# Altium project Volta_P0_Single_Port.PrjPcb (part 2 of 3)

## Sheet Charging_TI.SchDoc
size A4
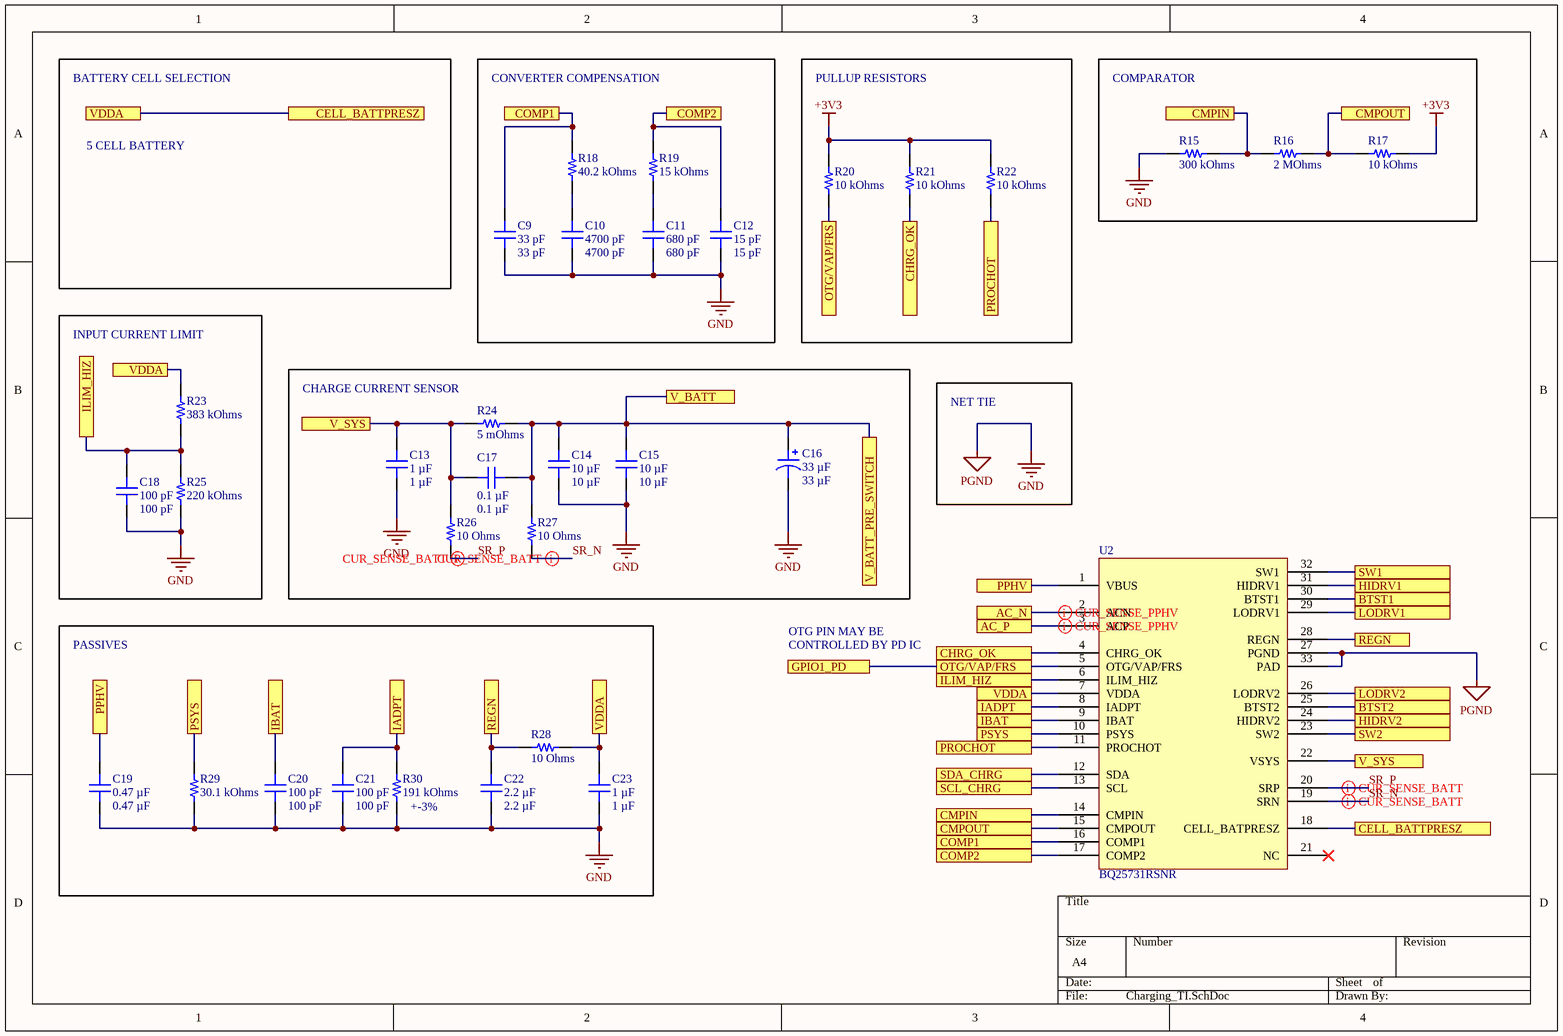
[diagram p2: Charging_TI.SchDoc]

### Parts
C9  33 pF  [CAP 0402_1005]
C10  4700 pF  [CAP 0402_1005]
C11  680 pF  [CAP 0402_1005]
C12  15 pF  [CAP 0402_1005]
C13  1 µF  [CAP 0402_1005]
C14  10 µF  [CAP 0805_2012]
C15  10 µF  [CAP 0805_2012]
C16  33 µF  [CAP POL 2917_7343]
C17  0.1 µF  [CAP 0603_1608]
C18  100 pF  [CAP 0603_1608]
C19  0.47 µF  [CAP 0805_2012]
C20  100 pF  [CAP 0603_1608]
C21  100 pF  [CAP 0603_1608]
C22  2.2 µF  [CAP 0603_1608]
C23  1 µF  [CAP 0603_1608]
R15  300 kOhms  [RES 0402_1005]
R16  2 MOhms  [RES 0402_1005]
R17  10 kOhms  [RES 0402_1005]
R18  40.2 kOhms  [RES 0402_1005]
R19  15 kOhms  [RES 0402_1005]
R20  10 kOhms  [RES 0402_1005]
R21  10 kOhms  [RES 0402_1005]
R22  10 kOhms  [RES 0402_1005]
R23  383 kOhms  [RES 0402_1005]
R24  5 mOhms  [RES 1206_3216]
R25  220 kOhms  [RES 0402_1005]
R26  10 Ohms  [RES 0603_1608]
R27  10 Ohms  [RES 0603_1608]
R28  10 Ohms  [RES 0603_1608]
R29  30.1 kOhms  [RES 0402_1005]
R30  191 kOhms  [RES 0402_1005]
U2  BQ25731RSNR  [QFN40P400X400X80_HS-33N]

### Blocks framed on the sheet
CONVERTER COMPENSATION: C9-C12 R18 R19
PULLUP RESISTORS: R20-R22
COMPARATOR: R15-R17
INPUT CURRENT LIMIT: C18 R23 R25
CHARGE CURRENT SENSOR: C13-C17 R24 R26 R27

### Ports
AC_N, AC_P, BTST1, BTST2, CELL_BATTPRESZ, CHRG_OK, CMPIN, CMPOUT, COMP1, COMP2, GPIO1_PD, HIDRV1, HIDRV2, IADPT, IBAT, ILIM_HIZ, LODRV1, LODRV2, OTG/VAP/FRS, PPHV, PROCHOT, PSYS, REGN, SCL_CHRG, SDA_CHRG, SW1, SW2, V_BATT, V_BATT_PRE_SWITCH, V_SYS, VDDA

### Nets
+3V3: R17.1 R20.2 R21.2 R22.2
GND: C9.1 C10.1 C11.1 C12.1 C13.2 C14.1 C15.1 C16.2 C18.1 C19.1 C20.1 C21.1 C22.1 C23.1 R15.1 R25.1 R29.1 R30.1 U2.27(PGND) U2.33(PAD)  [also labelled PGND]  [project net FUEL_BATT_SR_N]
AC_N: U2.2(ACN) ; port AC_N
AC_P: U2.3(ACP) ; port AC_P
BTST1: U2.30(BTST1) ; port BTST1
BTST2: U2.25(BTST2) ; port BTST2
CELL_BATTPRESZ: C23.2 R23.2 R28.2 U2.7(VDDA) U2.18(CELL_BATPRESZ) ; port CELL_BATTPRESZ, port VDDA
CHRG_OK: R21.1 U2.4(CHRG_OK) ; port CHRG_OK
CMPIN: R15.2 R16.1 U2.14(CMPIN) ; port CMPIN
CMPOUT: R16.2 R17.2 U2.15(CMPOUT) ; port CMPOUT
COMP1: C9.2 R18.2 U2.16(COMP1) ; port COMP1
COMP2: C12.2 R19.2 U2.17(COMP2) ; port COMP2
GPIO1_PD: R20.1 U2.5(OTG/VAP/FRS) ; port OTG/VAP/FRS, port GPIO1_PD
GPIO5_M: R22.1 U2.11(PROCHOT) ; port PROCHOT
HIDRV1: U2.31(HIDRV1) ; port HIDRV1
HIDRV2: U2.24(HIDRV2) ; port HIDRV2
I2CM_SCL: U2.13(SCL) ; port SCL_CHRG
I2CM_SDA: U2.12(SDA) ; port SDA_CHRG
IADPT: C21.2 R30.2 U2.8(IADPT) ; port IADPT
IBAT: C20.2 U2.9(IBAT) ; port IBAT
ILIM_HIZ: C18.2 R23.1 R25.2 U2.6(ILIM_HIZ) ; port ILIM_HIZ
LODRV1: U2.29(LODRV1) ; port LODRV1
LODRV2: U2.26(LODRV2) ; port LODRV2
PPHV: C19.2 U2.1(VBUS) ; port PPHV
PSYS: R29.2 U2.10(PSYS) ; port PSYS
REGN: C22.2 R28.1 U2.28(REGN) ; port REGN
SR_N: R27.1 U2.19(SRN)
SR_P: R26.1 U2.20(SRP)
SW1: U2.32(SW1) ; port SW1
SW2: U2.23(SW2) ; port SW2
V_BATT: C14.2 C15.2 C16.1 C17.2 R24.2 R27.2 ; port V_BATT_PRE_SWITCH, port V_BATT
V_SYS: C13.1 C17.1 R24.1 R26.2 U2.22(VSYS) ; port V_SYS
NetC10_2: C10.2 R18.1
NetC11_2: C11.2 R19.1

Not connected (* = marked no-connect by the designer): U2 21(NC)*

### Layout directives
differential pair; differential pair class CUR_SENSE_BATT: SR_N, SR_P
differential pair; differential pair class CUR_SENSE_PPHV: AC_N, AC_P

### Notes on the sheet
- BATTERY CELL SELECTION
- 5 CELL BATTERY
- NET TIE
- PASSIVES
- OTG PIN MAY BE
- CONTROLLED BY PD IC
- (near R30) +-3%

### Library data of the parts
C9 = UMK105CH330JVHF: CAP CER 33PF 50V CH 0402; manufacturer: Taiyo Yuden; Tolerance: ±5%; Part Number: UMK105CH330JVHF; Value: 33 pF; Applications: Automotive; Capacitance: 33 pF; componentlink2description: DigiKey Link; componentlink2url: https://www.digikey.com/en/products/detail/taiyo-yuden/UMK105CH330JVHF/6563672; Device Package: 0402 (1005 Metric); lastupdated: 14/08/2022 9:05:56 PM; Lifecycle Status: Active; Minimum Order: 1; Mounting Type: Surface Mount, MLCC; Package / Case: 0402 (1005 Metric); packaging: TapeAndReel; partid: 1883; Part Status: Active; price: 0.01; Ratings: AEC-Q200; series: M; Size / Dimension: 0.039" L x 0.020" W (1.00mm x 0.50mm); Supplier 1: DigiKey; Supplier Part Number 1: 587-5079-1-ND; Temperature Coefficient: CH; Voltage - Rated: 50V
C10 = 0402B472J500CT: CAP CER 4700PF 50V X7R 0402; manufacturer: Walsin Technology Corporation; Tolerance: ±5%; Part Number: 0402B472J500CT; Value: 4700 pF; Applications: General Purpose; Capacitance: 4700 pF; componentlink1description: Datasheet; componentlink1url: http://www.passivecomponent.com/wp-content/uploads/2018/10/MLCC.pdf; componentlink2description: DigiKey Link; componentlink2url: https://www.digikey.com/en/products/detail/walsin-technology-corporation/0402B472J500CT/9354708; Device Package: 0402 (1005 Metric); lastupdated: 14/08/2022 9:05:56 PM; Lifecycle Status: Active; Minimum Order: 1; Mounting Type: Surface Mount, MLCC; Operating Temperature: -55°C ~ 125°C; Package / Case: 0402 (1005 Metric); packaging: TapeAndReel; partid: 1879; Part Status: Active; price: 0.01; series: -; Size / Dimension: 0.039" L x 0.020" W (1.00mm x 0.50mm); Supplier 1: DigiKey; Supplier Part Number 1: 1292-1210-1-ND; Temperature Coefficient: X7R; Thickness (Max): 0.022" (0.55mm); Voltage - Rated: 50V
C11 = C1005NP01H681J050BA: CAP CER 680PF 50V NP0 0402; manufacturer: TDK Corporation; Temperature Coefficient: C0G, NP0; Tolerance: ±5%; Part Number: C1005NP01H681J050BA; Value: 680 pF; Applications: General Purpose; Capacitance: 680 pF; componentlink1description: Datasheet; componentlink1url: https://product.tdk.com/info/en/catalog/datasheets/mlcc_commercial_hightemp_en.pdf?ref_disty=digikey; componentlink2description: DigiKey Link; componentlink2url: https://www.digikey.com/en/products/detail/tdk-corporation/C1005NP01H681J050BA/3951045; Device Package: 0402 (1005 Metric); Features: High Temperature; lastupdated: 14/08/2022 9:05:57 PM; Lifecycle Status: Active; Minimum Order: 1; Mounting Type: Surface Mount, MLCC; Operating Temperature: -55°C ~ 150°C; Package / Case: 0402 (1005 Metric); packaging: TapeAndReel; partid: 1790; Part Status: Active; price: 0.02; series: C; Size / Dimension: 0.039" L x 0.020" W (1.00mm x 0.50mm); Supplier 1: DigiKey; Supplier Part Number 1: 445-13809-1-ND; Thickness (Max): 0.022" (0.55mm); Voltage - Rated: 50V
C12 = CBR04C150J5GAC: CAP CER 15PF 50V C0G/NP0 0402; manufacturer: KEMET; Temperature Coefficient: C0G, NP0; Tolerance: ±5%; Part Number: CBR04C150J5GAC; Value: 15 pF; Applications: RF, Microwave, High Frequency; Capacitance: 15 pF; componentlink1description: Datasheet; componentlink1url: https://api.kemet.com/component-edge/download/datasheet/CBR04C150J5GAC.pdf; componentlink2description: DigiKey Link; componentlink2url: https://www.digikey.com/en/products/detail/kemet/CBR04C150J5GAC/2732287; Device Package: 0402 (1005 Metric); Features: High Q, Low Loss, Ultra Low ESR; lastupdated: 14/08/2022 9:05:58 PM; Lifecycle Status: Active; Minimum Order: 1; Mounting Type: Surface Mount, MLCC; Operating Temperature: -55°C ~ 125°C; Package / Case: 0402 (1005 Metric); packaging: TapeAndReel; partid: 1728; Part Status: Active; price: 0.02; series: CBR-SMD RF C0G; Size / Dimension: 0.039" L x 0.020" W (1.00mm x 0.50mm); Supplier 1: DigiKey; Supplier Part Number 1: 399-6170-1-ND; Thickness (Max): 0.022" (0.55mm); Voltage - Rated: 50V
C13 = EMK105BJ105MV-F: CAP CER 1UF 16V X5R 0402; manufacturer: Taiyo Yuden; Tolerance: ±20%; Part Number: EMK105BJ105MV-F; Value: 1 µF; Applications: SMPS Filtering; Capacitance: 1 µF; componentlink1description: Datasheet; componentlink1url: https://ds.yuden.co.jp/TYCOMPAS/ut/detail?pn=EMK105BJ105MV-F  &u=M; componentlink2description: DigiKey Link; componentlink2url: https://www.digikey.com/en/products/detail/taiyo-yuden/EMK105BJ105MV-F/4970641; Device Package: 0402 (1005 Metric); lastupdated: 5/04/2023 7:05:02 PM; Lifecycle Status: Active; Minimum Order: 1; Mounting Type: Surface Mount, MLCC; Operating Temperature: -55°C ~ 85°C; Package / Case: 0402 (1005 Metric); packaging: TapeAndReel; partid: 1933; Part Status: Active; price: 0.01; series: M; Size / Dimension: 0.039" L x 0.020" W (1.00mm x 0.50mm); Supplier 1: DigiKey; Supplier Part Number 1: 587-5514-1-ND; Temperature Coefficient: X5R; Thickness (Max): 0.022" (0.55mm); Voltage - Rated: 16V
C14 C15 = GRM21BR61H106KE43L: CAP CER 10UF 50V X5R 0805; manufacturer: Murata Electronics; Tolerance: ±10%; Part Number: GRM21BR61H106KE43L; Value: 10 µF; Applications: General Purpose; Capacitance: 10 µF; componentlink1description: Datasheet; componentlink1url: https://search.murata.co.jp/Ceramy/image/img/A01X/G101/ENG/GRM21BR61H106KE43-01A.pdf; componentlink2description: DigiKey Link; componentlink2url: https://www.digikey.com/en/products/detail/murata-electronics/GRM21BR61H106KE43L/10326316; Device Package: 0805 (2012 Metric); lastupdated: 14/08/2022 9:12:57 PM; Lifecycle Status: Active; Minimum Order: 1; Mounting Type: Surface Mount, MLCC; Operating Temperature: -55°C ~ 85°C; Package / Case: 0805 (2012 Metric); packaging: TapeAndReel; partid: 39284; Part Status: Active; price: 0.07; series: GRM; Size / Dimension: 0.079" L x 0.049" W (2.00mm x 1.25mm); Supplier 1: DigiKey; Supplier Part Number 1: 490-18663-1-ND; Temperature Coefficient: X5R; Thickness (Max): 0.057" (1.45mm); Voltage - Rated: 50V
C16 = T495X336M035ATE175: CAP TANT 33UF 20% 35V 2917; manufacturer: KEMET; Manufacturer Size Code: X; ESR (Equivalent Series Resistance): 175mOhm; Lifetime @ Temp.: 2000 Hrs @ 85°C; Type: Molded; Part Number: T495X336M035ATE175; Value: 33 µF; Capacitance: 33 µF; componentlink1description: Datasheet; componentlink1url: https://api.kemet.com/component-edge/download/datasheet/T495X336M035ATE175.pdf; componentlink2description: DigiKey Link; componentlink2url: https://www.digikey.com/en/products/detail/kemet/T495X336M035ATE175/1833502; Device Package: 2917 (7343 Metric); Features: General Purpose; Height - Seated (Max): 0.169" (4.30mm); lastupdated: 14/08/2022 9:47:02 PM; Lifecycle Status: Active; Minimum Order: 1; Mounting Type: Surface Mount; Operating Temperature: -55°C ~ 125°C; Package / Case: 2917 (7343 Metric); packaging: TapeAndReel; partid: 698; Part Status: Active; price: 1.07; series: T495; Size / Dimension: 0.287" L x 0.169" W (7.30mm x 4.30mm); Supplier 1: DigiKey; Supplier Part Number 1: 399-5266-1-ND; Tolerance: ±20%; Voltage - Rated: 35 V
C17 = C0603C104K5RAC7411: CAP CER 0.1UF 50V X7R 0603; manufacturer: KEMET; Tolerance: ±10%; Part Number: C0603C104K5RAC7411; Value: 0.1 µF; Applications: Bypass, Decoupling; Capacitance: 0.1 µF; componentlink1description: Datasheet; componentlink1url: https://api.kemet.com/component-edge/download/datasheet/C0603C104K5RAC7411.pdf; componentlink2description: DigiKey Link; componentlink2url: https://www.digikey.com/en/products/detail/kemet/C0603C104K5RAC7411/3317013; Device Package: 0603 (1608 Metric); lastupdated: 14/08/2022 9:09:47 PM; Lifecycle Status: Active; Minimum Order: 15000; Mounting Type: Surface Mount, MLCC; Operating Temperature: -55°C ~ 125°C; Package / Case: 0603 (1608 Metric); packaging: TapeAndReel; partid: 2233; Part Status: Active; price: 0.01; series: SMD Comm X7R; Size / Dimension: 0.063" L x 0.031" W (1.60mm x 0.80mm); Supplier 1: DigiKey; Supplier Part Number 1: 399-7374-2-ND; Temperature Coefficient: X7R; Thickness (Max): 0.035" (0.90mm); Voltage - Rated: 50V
C18 C20 C21 = C0603C101K5GACAUTO: CAP CER 100PF 50V C0G/NP0 0603; manufacturer: KEMET; Temperature Coefficient: C0G, NP0; Tolerance: ±10%; Part Number: C0603C101K5GACAUTO; Value: 100 pF; Applications: Automotive; Capacitance: 100 pF; componentlink1description: Datasheet; componentlink1url: https://api.kemet.com/component-edge/download/datasheet/C0603C101K5GACAUTO.pdf; componentlink2description: DigiKey Link; componentlink2url: https://www.digikey.com/en/products/detail/kemet/C0603C101K5GACAUTO/3314842; Device Package: 0603 (1608 Metric); Features: Low ESL; lastupdated: 14/08/2022 9:09:47 PM; Lifecycle Status: Active; Minimum Order: 1; Mounting Type: Surface Mount, MLCC; Operating Temperature: -55°C ~ 125°C; Package / Case: 0603 (1608 Metric); packaging: TapeAndReel; partid: 2201; Part Status: Active; price: 0.01; Ratings: AEC-Q200; series: SMD Auto C0G; Size / Dimension: 0.063" L x 0.031" W (1.60mm x 0.80mm); Supplier 1: DigiKey; Supplier Part Number 1: 399-6843-1-ND; Thickness (Max): 0.034" (0.87mm); Voltage - Rated: 50V
C19 = C0805C474K5RACAUTO: CAP CER 0.47UF 50V X7R 0805; manufacturer: KEMET; Tolerance: ±10%; Part Number: C0805C474K5RACAUTO; Value: 0.47 µF; Applications: Automotive, Bypass, Decoupling; Capacitance: 0.47 µF; componentlink1description: Datasheet; componentlink1url: https://api.kemet.com/component-edge/download/datasheet/C0805C474K5RACAUTO.pdf; componentlink2description: DigiKey Link; componentlink2url: https://www.digikey.com/en/products/detail/kemet/C0805C474K5RACAUTO/3314969; Device Package: 0805 (2012 Metric); lastupdated: 14/08/2022 9:13:14 PM; Lifecycle Status: Active; Minimum Order: 1; Mounting Type: Surface Mount, MLCC; Operating Temperature: -55°C ~ 125°C; Package / Case: 0805 (2012 Metric); packaging: TapeAndReel; partid: 2727; Part Status: Active; price: 0.06; Ratings: AEC-Q200; series: SMD Auto X7R; Size / Dimension: 0.079" L x 0.049" W (2.00mm x 1.25mm); Supplier 1: DigiKey; Supplier Part Number 1: 399-6976-1-ND; Temperature Coefficient: X7R; Thickness (Max): 0.043" (1.10mm); Voltage - Rated: 50V
C22 = GRM188R6YA225KA12D: CAP CER 2.2UF 35V X5R 0603; manufacturer: Murata Electronics; Tolerance: ±10%; Part Number: GRM188R6YA225KA12D; Value: 2.2 µF; Applications: General Purpose; Capacitance: 2.2 µF; componentlink1description: Datasheet; componentlink1url: https://www.murata.com/~/media/webrenewal/support/library/catalog/products/capacitor/mlcc/c02e.ashx?la=en-us; componentlink2description: DigiKey Link; componentlink2url: https://www.digikey.com/en/products/detail/murata-electronics/GRM188R6YA225KA12D/3900462; Device Package: 0603 (1608 Metric); lastupdated: 14/08/2022 9:09:23 PM; Lifecycle Status: Active; Minimum Order: 1; Mounting Type: Surface Mount, MLCC; Operating Temperature: -55°C ~ 85°C; Package / Case: 0603 (1608 Metric); packaging: TapeAndReel; partid: 11175; Part Status: Active; price: 0.03; series: GRM; Size / Dimension: 0.063" L x 0.031" W (1.60mm x 0.80mm); Supplier 1: DigiKey; Supplier Part Number 1: 490-7204-1-ND; Temperature Coefficient: X5R; Thickness (Max): 0.035" (0.90mm); Voltage - Rated: 35V
C23 = GMJ107CB7105KAHR: CAP CER 1UF 35V X7R 0603; manufacturer: Taiyo Yuden; Tolerance: ±10%; Part Number: GMJ107CB7105KAHR; Value: 1 µF; Applications: Automotive, Boardflex Sensitive; Capacitance: 1 µF; componentlink1description: Datasheet; componentlink1url: https://www.yuden.co.jp/productdata/catalog//mlcc11_hq_e.pdf; componentlink2description: DigiKey Link; componentlink2url: https://www.digikey.com/en/products/detail/taiyo-yuden/GMJ107CB7105KAHR/5405535; Device Package: 0603 (1608 Metric); Features: Soft Termination; lastupdated: 14/08/2022 9:09:37 PM; Lifecycle Status: Active; Minimum Order: 1; Mounting Type: Surface Mount, MLCC; Operating Temperature: -55°C ~ 125°C; Package / Case: 0603 (1608 Metric); packaging: TapeAndReel; partid: 5874; Part Status: Active; price: 0.06; Ratings: AEC-Q200; series: M; Size / Dimension: 0.063" L x 0.031" W (1.60mm x 0.80mm); Supplier 1: DigiKey; Supplier Part Number 1: 587-4356-1-ND; Temperature Coefficient: X7R; Thickness (Max): 0.035" (0.90mm); Voltage - Rated: 35V
R15 = RC0402FR-07300KL: RES 300K OHM 1% 1/16W 0402; Manufacturer: Yageo; Power (Watts): 0.063W, 1/16W; Temperature Coefficient: ±100ppm/°C; Part Number: RC0402FR-07300KL; Value: 300 kOhms; ComponentLink1Description: Datasheet; ComponentLink1URL: https://www.yageo.com/upload/media/product/productsearch/datasheet/rchip/PYu-RC_Group_51_RoHS_L_10.pdf; ComponentLink2Description: DigiKey Link; ComponentLink2URL: https://www.digikey.com/en/products/detail/yageo/RC0402FR-07300KL/726588; Composition: Thick Film; Device Package: 0402 (1005 Metric); Features: Moisture Resistant; Height - Seated (Max): 0.016" (0.40mm); LastUpdated: 4/04/2023 7:23:10 PM; Lifecycle Status: Active; Minimum Order: 1; Number of Terminations: 2; Operating Temperature: -55°C ~ 155°C; Package / Case: 0402 (1005 Metric); Packaging: CutTape; PartId: 2649; Part Status: Active; Price: 0.01; Resistance: 300 kOhms; Series: RC_L; Size / Dimension: 0.039" L x 0.020" W (1.00mm x 0.50mm); Supplier 1: DigiKey; Supplier Part Number 1: 311-300KLRCT-ND; Supplier Device Package: 0402; Tolerance: ±1%
R16 = RMCF0402JT2M00: RES 2M OHM 5% 1/16W 0402; Manufacturer: Stackpole Electronics Inc; Power (Watts): 0.063W, 1/16W; Temperature Coefficient: ±200ppm/°C; Part Number: RMCF0402JT2M00; Value: 2 MOhms; ComponentLink1Description: Datasheet; ComponentLink1URL: https://www.seielect.com/catalog/sei-rmcf_rmcp.pdf; ComponentLink2Description: DigiKey Link; ComponentLink2URL: https://www.digikey.com/en/products/detail/stackpole-electronics-inc/RMCF0402JT2M00/1712425; Composition: Thick Film; Device Package: 0402 (1005 Metric); Features: Automotive AEC-Q200; Height - Seated (Max): 0.016" (0.40mm); LastUpdated: 4/04/2023 7:23:09 PM; Lifecycle Status: Active; Minimum Order: 1; Number of Terminations: 2; Operating Temperature: -55°C ~ 155°C; Package / Case: 0402 (1005 Metric); Packaging: CutTape; PartId: 2925; Part Status: Active; Price: 0.01; Ratings: AEC-Q200; Resistance: 2 MOhms; Series: RMCF; Size / Dimension: 0.039" L x 0.020" W (1.00mm x 0.50mm); Supplier 1: DigiKey; Supplier Part Number 1: 738-RMCF0402JT2M00CT-ND; Supplier Device Package: 0402; Tolerance: ±5%
R17 R20-R22 = RC0402JR-1310KL: RES 10K OHM 5% 1/16W 0402; Manufacturer: Yageo; Power (Watts): 0.063W, 1/16W; Temperature Coefficient: ±100ppm/°C; Part Number: RC0402JR-1310KL; Value: 10 kOhms; ComponentLink1Description: Datasheet; ComponentLink1URL: https://www.yageo.com/upload/media/product/productsearch/datasheet/rchip/PYu-RC_Group_51_RoHS_L_11.pdf; ComponentLink2Description: DigiKey Link; ComponentLink2URL: https://www.digikey.com/en/products/detail/yageo/RC0402JR-1310KL/13694115; Composition: Thick Film; Device Package: 0402 (1005 Metric); Features: Moisture Resistant; Height - Seated (Max): 0.016" (0.40mm); LastUpdated: 4/04/2023 7:21:31 PM; Lifecycle Status: Active; Minimum Order: 50000; Number of Terminations: 2; Operating Temperature: -55°C ~ 155°C; Package / Case: 0402 (1005 Metric); PartId: 69237; Part Status: Active; Price: 0; Resistance: 10 kOhms; Series: RC_L; Size / Dimension: 0.039" L x 0.020" W (1.00mm x 0.50mm); Supplier 1: DigiKey; Supplier Part Number 1: 13-RC0402JR-1310KLTR-ND; Supplier Device Package: 0402; Tolerance: ±5%
R18 = RC0402FR-0740K2L: RES 40.2K OHM 1% 1/16W 0402; Manufacturer: Yageo; Power (Watts): 0.063W, 1/16W; Temperature Coefficient: ±100ppm/°C; Part Number: RC0402FR-0740K2L; Value: 40.2 kOhms; ComponentLink1Description: Datasheet; ComponentLink1URL: https://www.yageo.com/upload/media/product/productsearch/datasheet/rchip/PYu-RC_Group_51_RoHS_L_10.pdf; ComponentLink2Description: DigiKey Link; ComponentLink2URL: https://www.digikey.com/en/products/detail/yageo/RC0402FR-0740K2L/726607; Composition: Thick Film; Device Package: 0402 (1005 Metric); Features: Moisture Resistant; Height - Seated (Max): 0.016" (0.40mm); LastUpdated: 14/08/2022 9:24:17 PM; Lifecycle Status: Active; Minimum Order: 1; Number of Terminations: 2; Operating Temperature: -55°C ~ 155°C; Package / Case: 0402 (1005 Metric); Packaging: CutTape; PartId: 2526; Part Status: Active; Price: 0.01; Resistance: 40.2 kOhms; Series: RC_L; Size / Dimension: 0.039" L x 0.020" W (1.00mm x 0.50mm); Supplier 1: DigiKey; Supplier Part Number 1: 311-40.2KLRCT-ND; Supplier Device Package: 0402; Tolerance: ±1%
R19 = RC0402FR-1315KL: RES 15K OHM 1% 1/16W 0402; Manufacturer: Yageo; Power (Watts): 0.063W, 1/16W; Temperature Coefficient: ±100ppm/°C; Part Number: RC0402FR-1315KL; Value: 15 kOhms; ComponentLink1Description: Datasheet; ComponentLink1URL: https://www.yageo.com/upload/media/product/productsearch/datasheet/rchip/PYu-RC_Group_51_RoHS_L_11.pdf; ComponentLink2Description: DigiKey Link; ComponentLink2URL: https://www.digikey.com/en/products/detail/yageo/RC0402FR-1315KL/13694190; Composition: Thick Film; Device Package: 0402 (1005 Metric); Features: Moisture Resistant; Height - Seated (Max): 0.016" (0.40mm); LastUpdated: 14/08/2022 9:22:52 PM; Lifecycle Status: Active; Minimum Order: 50000; Number of Terminations: 2; Operating Temperature: -55°C ~ 155°C; Package / Case: 0402 (1005 Metric); PartId: 65094; Part Status: Active; Price: 0; Resistance: 15 kOhms; Series: RC_L; Size / Dimension: 0.039" L x 0.020" W (1.00mm x 0.50mm); Supplier 1: DigiKey; Supplier Part Number 1: 13-RC0402FR-1315KLTR-ND; Supplier Device Package: 0402; Tolerance: ±1%
R23 = ERJ-2RKF3833X: RES SMD 383K OHM 1% 1/10W 0402; Manufacturer: Panasonic Electronic Components; Power (Watts): 0.1W, 1/10W; Temperature Coefficient: ±100ppm/°C; Part Number: ERJ-2RKF3833X; Value: 383 kOhms; ComponentLink1Description: Datasheet; ComponentLink1URL: https://industrial.panasonic.com/cdbs/www-data/pdf/RDA0000/AOA0000C304.pdf; ComponentLink2Description: DigiKey Link; ComponentLink2URL: https://www.digikey.com/en/products/detail/panasonic-electronic-components/ERJ-2RKF3833X/192331; Composition: Thick Film; Device Package: 0402 (1005 Metric); Features: Automotive AEC-Q200; Height - Seated (Max): 0.016" (0.40mm); LastUpdated: 4/04/2023 7:23:06 PM; Lifecycle Status: Active; Minimum Order: 1; Number of Terminations: 2; Operating Temperature: -55°C ~ 155°C; Package / Case: 0402 (1005 Metric); Packaging: CutTape; PartId: 3860; Part Status: Active; Price: 0.01; Ratings: AEC-Q200; Resistance: 383 kOhms; Series: ERJ-2RK; Size / Dimension: 0.039" L x 0.020" W (1.00mm x 0.50mm); Supplier 1: DigiKey; Supplier Part Number 1: P383KLCT-ND; Supplier Device Package: 0402; Tolerance: ±1%
R24 = PMR18EZPJU5L0: RES 0.005 OHM 5% 1W 1206; Manufacturer: Rohm Semiconductor; Temperature Coefficient: ±100ppm/°C; Part Number: PMR18EZPJU5L0; ComponentLink1Description: Datasheet; ComponentLink1URL: https://www.rohm.com/datasheet/PMR18EZPFV/pmr-e; ComponentLink2Description: DigiKey Link; ComponentLink2URL: https://www.digikey.com/en/products/detail/rohm-semiconductor/PMR18EZPJU5L0/2094212; Composition: Metal Element; Device Package: 1206 (3216 Metric); Features: Automotive AEC-Q200, Current Sense; Height - Seated (Max): 0.017" (0.43mm); LastUpdated: 14/08/2022 9:38:16 PM; Lifecycle Status: Active; Minimum Order: 1; Number of Terminations: 2; Operating Temperature: -55°C ~ 155°C; Package / Case: 1206 (3216 Metric); Packaging: TapeAndReel; PartId: 27011; Part Status: Active; Power (Watts): 1W; Price: 0.11; Ratings: AEC-Q200; Resistance: 5 mOhms; Series: PMR; Size / Dimension: 0.126" L x 0.063" W (3.20mm x 1.60mm); Supplier 1: DigiKey; Supplier Part Number 1: RHM.005AMCT-ND; Supplier Device Package: 1206; Tolerance: ±5%; Value: 5 mOhms
R25 = RC0402FR-07220KL: RES 220K OHM 1% 1/16W 0402; Manufacturer: Yageo; Power (Watts): 0.063W, 1/16W; Temperature Coefficient: ±100ppm/°C; Part Number: RC0402FR-07220KL; Value: 220 kOhms; ComponentLink1Description: Datasheet; ComponentLink1URL: https://www.yageo.com/upload/media/product/productsearch/datasheet/rchip/PYu-RC_Group_51_RoHS_L_10.pdf; ComponentLink2Description: DigiKey Link; ComponentLink2URL: https://www.digikey.com/en/products/detail/yageo/RC0402FR-07220KL/726564; Composition: Thick Film; Device Package: 0402 (1005 Metric); Features: Moisture Resistant; Height - Seated (Max): 0.016" (0.40mm); LastUpdated: 4/04/2023 7:23:10 PM; Lifecycle Status: Active; Minimum Order: 1; Number of Terminations: 2; Operating Temperature: -55°C ~ 155°C; Package / Case: 0402 (1005 Metric); Packaging: CutTape; PartId: 2589; Part Status: Active; Price: 0.01; Resistance: 220 kOhms; Series: RC_L; Size / Dimension: 0.039" L x 0.020" W (1.00mm x 0.50mm); Supplier 1: DigiKey; Supplier Part Number 1: 311-220KLRCT-ND; Supplier Device Package: 0402; Tolerance: ±1%
R26-R28 = ERJ-3EKF10R0V: RES SMD 10 OHM 1% 1/10W 0603; Manufacturer: Panasonic Electronic Components; Power (Watts): 0.1W, 1/10W; Temperature Coefficient: ±100ppm/°C; Part Number: ERJ-3EKF10R0V; Value: 10 Ohms; ComponentLink1Description: Datasheet; ComponentLink1URL: https://industrial.panasonic.com/cdbs/www-data/pdf/RDA0000/AOA0000C304.pdf; ComponentLink2Description: DigiKey Link; ComponentLink2URL: https://www.digikey.com/en/products/detail/panasonic-electronic-components/ERJ-3EKF10R0V/196065; Composition: Thick Film; Device Package: 0603 (1608 Metric); Features: Automotive AEC-Q200; Height - Seated (Max): 0.022" (0.55mm); LastUpdated: 14/08/2022 9:31:25 PM; Lifecycle Status: Active; Minimum Order: 1; Number of Terminations: 2; Operating Temperature: -55°C ~ 155°C; Package / Case: 0603 (1608 Metric); Packaging: TapeAndReel; PartId: 5647; Part Status: Active; Price: 0.01; Ratings: AEC-Q200; Resistance: 10 Ohms; Series: ERJ-3EK; Size / Dimension: 0.063" L x 0.031" W (1.60mm x 0.80mm); Supplier 1: DigiKey; Supplier Part Number 1: P10.0HCT-ND; Supplier Device Package: 0603; Tolerance: ±1%
R29 = RC0402FR-0730K1L: RES 30.1K OHM 1% 1/16W 0402; Manufacturer: Yageo; Power (Watts): 0.063W, 1/16W; Temperature Coefficient: ±100ppm/°C; Part Number: RC0402FR-0730K1L; Value: 30.1 kOhms; ComponentLink1Description: Datasheet; ComponentLink1URL: https://www.yageo.com/upload/media/product/productsearch/datasheet/rchip/PYu-RC_Group_51_RoHS_L_10.pdf; ComponentLink2Description: DigiKey Link; ComponentLink2URL: https://www.digikey.com/en/products/detail/yageo/RC0402FR-0730K1L/726587; Composition: Thick Film; Device Package: 0402 (1005 Metric); Features: Moisture Resistant; Height - Seated (Max): 0.016" (0.40mm); LastUpdated: 4/04/2023 7:23:11 PM; Lifecycle Status: Active; Minimum Order: 1; Number of Terminations: 2; Operating Temperature: -55°C ~ 155°C; Package / Case: 0402 (1005 Metric); Packaging: CutTape; PartId: 2546; Part Status: Active; Price: 0.01; Resistance: 30.1 kOhms; Series: RC_L; Size / Dimension: 0.039" L x 0.020" W (1.00mm x 0.50mm); Supplier 1: DigiKey; Supplier Part Number 1: 311-30.1KLRCT-ND; Supplier Device Package: 0402; Tolerance: ±1%
R30 = ERJ-2RKF1913X: RES SMD 191K OHM 1% 1/10W 0402; Manufacturer: Panasonic Electronic Components; Power (Watts): 0.1W, 1/10W; Temperature Coefficient: ±100ppm/°C; Part Number: ERJ-2RKF1913X; Value: 191 kOhms; ComponentLink1Description: Datasheet; ComponentLink1URL: https://industrial.panasonic.com/cdbs/www-data/pdf/RDA0000/AOA0000C304.pdf; ComponentLink2Description: DigiKey Link; ComponentLink2URL: https://www.digikey.com/en/products/detail/panasonic-electronic-components/ERJ-2RKF1913X/192191; Composition: Thick Film; Device Package: 0402 (1005 Metric); Features: Automotive AEC-Q200; Height - Seated (Max): 0.016" (0.40mm); LastUpdated: 4/04/2023 7:23:06 PM; Lifecycle Status: Active; Minimum Order: 1; Number of Terminations: 2; Operating Temperature: -55°C ~ 155°C; Package / Case: 0402 (1005 Metric); Packaging: CutTape; PartId: 3700; Part Status: Active; Price: 0.01; Ratings: AEC-Q200; Resistance: 191 kOhms; Series: ERJ-2RK; Size / Dimension: 0.039" L x 0.020" W (1.00mm x 0.50mm); Supplier 1: DigiKey; Supplier Part Number 1: P191KLCT-ND; Supplier Device Package: 0402; Tolerance: ±1%
U2 = BQ25731RSNR: I2C 1- to 5-Cell Buck-Boost Battery Charge Controller with USB-C PD 3.0 OTG Output

## Sheet Charging_TI_2.SchDoc
size A4
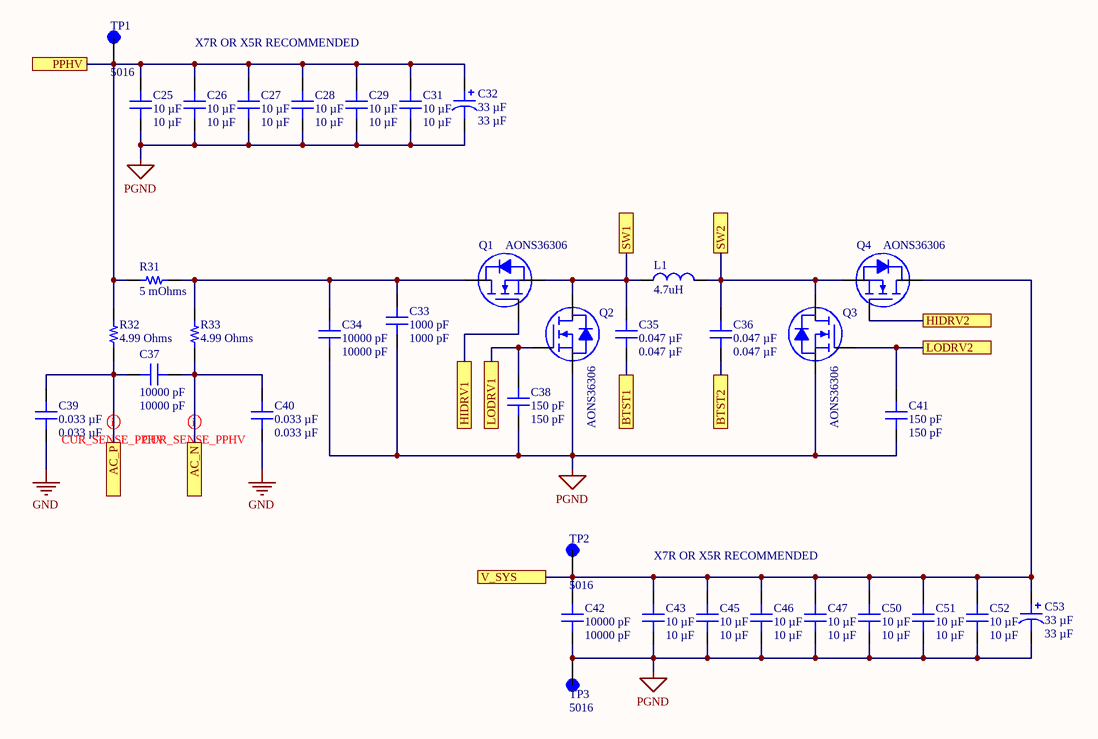
[diagram p3: Charging_TI_2.SchDoc]

### Parts
C25  10 µF  [CAP 0805_2012]
C26  10 µF  [CAP 0805_2012]
C27  10 µF  [CAP 0805_2012]
C28  10 µF  [CAP 0805_2012]
C29  10 µF  [CAP 0805_2012]
C31  10 µF  [CAP 0805_2012]
C32  33 µF  [CAP POL 2917_7343]
C33  1000 pF  [CAP 0402_1005]
C34  10000 pF  [CAP 0402_1005]
C35  0.047 µF  [CAP 0603_1608]
C36  0.047 µF  [CAP 0603_1608]
C37  10000 pF  [CAP 0603_1608]
C38  150 pF  [CAP 0603_1608]
C39  0.033 µF  [CAP 0603_1608]
C40  0.033 µF  [CAP 0603_1608]
C41  150 pF  [CAP 0603_1608]
C42  10000 pF  [CAP 0603_1608]
C43  10 µF  [CAP 0805_2012]
C45  10 µF  [CAP 0805_2012]
C46  10 µF  [CAP 0805_2012]
C47  10 µF  [CAP 0805_2012]
C50  10 µF  [CAP 0805_2012]
C51  10 µF  [CAP 0805_2012]
C52  10 µF  [CAP 0805_2012]
C53  33 µF  [CAP POL 2917_7343]
L1  4.7uH  [BMQADY1010404R7MA1]
Q1  AONS36306  [DFN 5x6]
Q2  AONS36306  [DFN 5x6]
Q3  AONS36306  [DFN 5x6]
Q4  AONS36306  [DFN 5x6]
R31  5 mOhms  [RES 1206_3216]
R32  4.99 Ohms  [RES 0603_1608]
R33  4.99 Ohms  [RES 0603_1608]
TP1  5016  [KEYSTONE_5016]  (no BOM)
TP2  5016  [KEYSTONE_5016]  (no BOM)
TP3  5016  [KEYSTONE_5016]  (no BOM)

### Ports
AC_N, AC_P, BTST1, BTST2, HIDRV1, HIDRV2, LODRV1, LODRV2, PPHV, SW1, SW2, V_SYS

### Nets
GND: C25.1 C26.1 C27.1 C28.1 C29.1 C31.1 C32.2 C33.1 C34.1 C38.1 C39.1 C40.1 C41.1 C42.1 C43.1 C45.1 C46.1 C47.1 C50.1 C51.1 C52.1 C53.2 Q2.S Q3.S TP3.TP  [also labelled PGND]  [project net FUEL_BATT_SR_N]
AC_N: C37.1 C40.2 R33.1 ; port AC_N
AC_P: C37.2 C39.2 R32.1 ; port AC_P
BTST1: C35.1 ; port BTST1
BTST2: C36.1 ; port BTST2
HIDRV1: Q1.G ; port HIDRV1
HIDRV2: Q4.G ; port HIDRV2
LODRV1: C38.2 Q2.G ; port LODRV1
LODRV2: C41.2 Q3.G ; port LODRV2
PPHV: C25.2 C26.2 C27.2 C28.2 C29.2 C31.2 C32.1 R31.1 R32.2 TP1.TP ; port PPHV
SW1: C35.2 L1.1 Q1.S Q2.D ; port SW1
SW2: C36.2 L1.2 Q3.D Q4.S ; port SW2
V_SYS: C42.2 C43.2 C45.2 C46.2 C47.2 C50.2 C51.2 C52.2 C53.1 Q4.D TP2.TP ; port V_SYS
NetC33_2: C33.2 C34.2 Q1.D R31.2 R33.2

### Layout directives
differential pair; differential pair class CUR_SENSE_PPHV: AC_N, AC_P

### Notes on the sheet
- X7R OR X5R RECOMMENDED

### Library data of the parts
C25-C29 C31 C43 C45-C47 C50-C52 = GRM21BR61H106KE43L: as C14 on sheet Charging_TI; Part Number: GRM21BR61H106KE43L; Value: 10 µF; Applications: General Purpose; Capacitance: 10 µF; componentlink1description: Datasheet; componentlink1url: https://search.murata.co.jp/Ceramy/image/img/A01X/G101/ENG/GRM21BR61H106KE43-01A.pdf; componentlink2description: DigiKey Link; componentlink2url: https://www.digikey.com/en/products/detail/murata-electronics/GRM21BR61H106KE43L/10326316; Device Package: 0805 (2012 Metric); lastupdated: 14/08/2022 9:12:57 PM; Lifecycle Status: Active; Minimum Order: 1; Mounting Type: Surface Mount, MLCC; Operating Temperature: -55°C ~ 85°C; Package / Case: 0805 (2012 Metric); packaging: TapeAndReel; partid: 39284; Part Status: Active; price: 0.07; series: GRM; Size / Dimension: 0.079" L x 0.049" W (2.00mm x 1.25mm); Supplier 1: DigiKey; Supplier Part Number 1: 490-18663-1-ND; Temperature Coefficient: X5R; Thickness (Max): 0.057" (1.45mm); Voltage - Rated: 50V
C32 C53 = T495X336M035ATE175: as C16 on sheet Charging_TI; Part Number: T495X336M035ATE175; Value: 33 µF; Capacitance: 33 µF; componentlink1description: Datasheet; componentlink1url: https://api.kemet.com/component-edge/download/datasheet/T495X336M035ATE175.pdf; componentlink2description: DigiKey Link; componentlink2url: https://www.digikey.com/en/products/detail/kemet/T495X336M035ATE175/1833502; Device Package: 2917 (7343 Metric); Features: General Purpose; Height - Seated (Max): 0.169" (4.30mm); lastupdated: 14/08/2022 9:47:02 PM; Lifecycle Status: Active; Minimum Order: 1; Mounting Type: Surface Mount; Operating Temperature: -55°C ~ 125°C; Package / Case: 2917 (7343 Metric); packaging: TapeAndReel; partid: 698; Part Status: Active; price: 1.07; series: T495; Size / Dimension: 0.287" L x 0.169" W (7.30mm x 4.30mm); Supplier 1: DigiKey; Supplier Part Number 1: 399-5266-1-ND; Tolerance: ±20%; Voltage - Rated: 35 V
C33 = UMK105CG102JVHF: CAP CER 1000PF 50V NP0 0402; manufacturer: Taiyo Yuden; Temperature Coefficient: C0G, NP0; Tolerance: ±5%; Part Number: UMK105CG102JVHF; Value: 1000 pF; Applications: Automotive; Capacitance: 1000 pF; componentlink1description: Datasheet; componentlink1url: https://ds.yuden.co.jp/TYCOMPAS/ut/detail?pn=UMK105CG102JVHF &u=M; componentlink2description: DigiKey Link; componentlink2url: https://www.digikey.com/en/products/detail/taiyo-yuden/UMK105CG102JVHF/4811103; Device Package: 0402 (1005 Metric); lastupdated: 14/08/2022 9:05:57 PM; Lifecycle Status: Active; Minimum Order: 1; Mounting Type: Surface Mount, MLCC; Operating Temperature: -55°C ~ 125°C; Package / Case: 0402 (1005 Metric); packaging: TapeAndReel; partid: 1779; Part Status: Active; price: 0.01; Ratings: AEC-Q200; series: M; Size / Dimension: 0.039" L x 0.020" W (1.00mm x 0.50mm); Supplier 1: DigiKey; Supplier Part Number 1: 587-3737-1-ND; Thickness (Max): 0.022" (0.55mm); Voltage - Rated: 50V
C34 = TMK105BJ103KP-F: CAP CER 10000PF 25V X5R 0402; manufacturer: Taiyo Yuden; Tolerance: ±10%; Part Number: TMK105BJ103KP-F; Value: 10000 pF; Applications: SMPS Filtering; Capacitance: 10000 pF; componentlink1description: Datasheet; componentlink1url: https://ds.yuden.co.jp/TYCOMPAS/ut/detail?pn=TMK105BJ103KP-F  &u=M; componentlink2description: DigiKey Link; componentlink2url: https://www.digikey.com/en/products/detail/taiyo-yuden/TMK105BJ103KP-F/5182051; Device Package: 0402 (1005 Metric); lastupdated: 9/05/2023 7:07:51 PM; Lifecycle Status: Active; Minimum Order: 1; Mounting Type: Surface Mount, MLCC; Operating Temperature: -55°C ~ 85°C; Package / Case: 0402 (1005 Metric); packaging: TapeAndReel; partid: 1788; Part Status: Active; price: 0.01; series: M; Size / Dimension: 0.039" L x 0.020" W (1.00mm x 0.50mm); Supplier 1: DigiKey; Supplier Part Number 1: 587-5593-1-ND; Temperature Coefficient: X5R; Thickness (Max): 0.022" (0.55mm); Voltage - Rated: 25V
C35 C36 = C0603C473K3RACAUTO: CAP CER 0.047UF 25V X7R 0603; manufacturer: KEMET; Tolerance: ±10%; Part Number: C0603C473K3RACAUTO; Value: 0.047 µF; Applications: Automotive, Bypass, Decoupling; Capacitance: 0.047 µF; componentlink1description: Datasheet; componentlink1url: https://api.kemet.com/component-edge/download/datasheet/C0603C473K3RACAUTO.pdf; componentlink2description: DigiKey Link; componentlink2url: https://www.digikey.com/en/products/detail/kemet/C0603C473K3RACAUTO/3314894; Device Package: 0603 (1608 Metric); lastupdated: 14/08/2022 9:09:47 PM; Lifecycle Status: Active; Minimum Order: 1; Mounting Type: Surface Mount, MLCC; Operating Temperature: -55°C ~ 125°C; Package / Case: 0603 (1608 Metric); packaging: TapeAndReel; partid: 2309; Part Status: Active; price: 0.02; Ratings: AEC-Q200; series: SMD Auto X7R; Size / Dimension: 0.063" L x 0.031" W (1.60mm x 0.80mm); Supplier 1: DigiKey; Supplier Part Number 1: 399-6899-1-ND; Temperature Coefficient: X7R; Thickness (Max): 0.034" (0.87mm); Voltage - Rated: 25V
C37 C42 = CGA3E2NP01H103J080AA: CAP CER 10000PF 50V NP0 0603; manufacturer: TDK Corporation; Temperature Coefficient: C0G, NP0; Tolerance: ±5%; Part Number: CGA3E2NP01H103J080AA; Value: 10000 pF; Applications: Automotive; Capacitance: 10000 pF; componentlink1description: Datasheet; componentlink1url: https://product.tdk.com/info/en/catalog/datasheets/mlcc_automotive_hightemp_en.pdf?ref_disty=digikey; componentlink2description: DigiKey Link; componentlink2url: https://www.digikey.com/en/products/detail/tdk-corporation/CGA3E2NP01H103J080AA/3949619; Device Package: 0603 (1608 Metric); Features: High Temperature; lastupdated: 14/08/2022 9:09:46 PM; Lifecycle Status: Active; Minimum Order: 1; Mounting Type: Surface Mount, MLCC; Operating Temperature: -55°C ~ 150°C; Package / Case: 0603 (1608 Metric); packaging: TapeAndReel; partid: 2625; Part Status: Active; price: 0.08; Ratings: AEC-Q200; series: CGA; Size / Dimension: 0.063" L x 0.031" W (1.60mm x 0.80mm); Supplier 1: DigiKey; Supplier Part Number 1: 445-12383-1-ND; Thickness (Max): 0.035" (0.90mm); Voltage - Rated: 50V
C38 C41 = CC0603KRNPO9BN151: CAP CER 150PF 50V C0G/NPO 0603; manufacturer: Yageo; Temperature Coefficient: C0G, NP0; Tolerance: ±10%; Part Number: CC0603KRNPO9BN151; Value: 150 pF; Applications: General Purpose; Capacitance: 150 pF; componentlink1description: Datasheet; componentlink1url: https://www.yageo.com/upload/media/product/productsearch/datasheet/mlcc/UPY-GP_NP0_16V-to-50V_17.pdf; componentlink2description: DigiKey Link; componentlink2url: https://www.digikey.com/en/products/detail/yageo/CC0603KRNPO9BN151/5883706; Device Package: 0603 (1608 Metric); lastupdated: 14/08/2022 9:09:44 PM; Lifecycle Status: Active; Minimum Order: 1; Mounting Type: Surface Mount, MLCC; Operating Temperature: -55°C ~ 125°C; Package / Case: 0603 (1608 Metric); packaging: TapeAndReel; partid: 3558; Part Status: Active; price: 0.01; series: CC; Size / Dimension: 0.063" L x 0.031" W (1.60mm x 0.80mm); Supplier 1: DigiKey; Supplier Part Number 1: 311-4029-1-ND; Thickness (Max): 0.035" (0.90mm); Voltage - Rated: 50V
C39 C40 = C0603C333K5RACAUTO: CAP CER 0.033UF 50V X7R 0603; manufacturer: KEMET; Tolerance: ±10%; Part Number: C0603C333K5RACAUTO; Value: 0.033 µF; Applications: Automotive, Bypass, Decoupling; Capacitance: 0.033 µF; componentlink1description: Datasheet; componentlink1url: https://api.kemet.com/component-edge/download/datasheet/C0603C333K5RACAUTO.pdf; componentlink2description: DigiKey Link; componentlink2url: https://www.digikey.com/en/products/detail/kemet/C0603C333K5RACAUTO/3314880; Device Package: 0603 (1608 Metric); lastupdated: 14/08/2022 9:09:47 PM; Lifecycle Status: Active; Minimum Order: 1; Mounting Type: Surface Mount, MLCC; Operating Temperature: -55°C ~ 125°C; Package / Case: 0603 (1608 Metric); packaging: TapeAndReel; partid: 2224; Part Status: Active; price: 0.01; Ratings: AEC-Q200; series: SMD Auto X7R; Size / Dimension: 0.063" L x 0.031" W (1.60mm x 0.80mm); Supplier 1: DigiKey; Supplier Part Number 1: 399-6884-1-ND; Temperature Coefficient: X7R; Thickness (Max): 0.034" (0.87mm); Voltage - Rated: 50V
L1 = BMQADY1010404R7MA1
Q1-Q4 = AONS36306: 30V N-Channel MOSFET
R31 = PMR18EZPJU5L0: as R24 on sheet Charging_TI; Part Number: PMR18EZPJU5L0; ComponentLink1Description: Datasheet; ComponentLink1URL: https://www.rohm.com/datasheet/PMR18EZPFV/pmr-e; ComponentLink2Description: DigiKey Link; ComponentLink2URL: https://www.digikey.com/en/products/detail/rohm-semiconductor/PMR18EZPJU5L0/2094212; Composition: Metal Element; Device Package: 1206 (3216 Metric); Features: Automotive AEC-Q200, Current Sense; Height - Seated (Max): 0.017" (0.43mm); LastUpdated: 14/08/2022 9:38:16 PM; Lifecycle Status: Active; Minimum Order: 1; Number of Terminations: 2; Operating Temperature: -55°C ~ 155°C; Package / Case: 1206 (3216 Metric); Packaging: TapeAndReel; PartId: 27011; Part Status: Active; Power (Watts): 1W; Price: 0.11; Ratings: AEC-Q200; Resistance: 5 mOhms; Series: PMR; Size / Dimension: 0.126" L x 0.063" W (3.20mm x 1.60mm); Supplier 1: DigiKey; Supplier Part Number 1: RHM.005AMCT-ND; Supplier Device Package: 1206; Tolerance: ±5%; Value: 5 mOhms
R32 R33 = RC0603FR-074R99L: RES 4.99 OHM 1% 1/10W 0603; Manufacturer: Yageo; Power (Watts): 0.1W, 1/10W; Temperature Coefficient: ±200ppm/°C; Part Number: RC0603FR-074R99L; Value: 4.99 Ohms; ComponentLink1Description: Datasheet; ComponentLink1URL: https://www.yageo.com/upload/media/product/productsearch/datasheet/rchip/PYu-RC_Group_51_RoHS_L_10.pdf; ComponentLink2Description: DigiKey Link; ComponentLink2URL: https://www.digikey.com/en/products/detail/yageo/RC0603FR-074R99L/727218; Composition: Thick Film; Device Package: 0603 (1608 Metric); Features: Moisture Resistant; Height - Seated (Max): 0.022" (0.55mm); LastUpdated: 14/08/2022 9:31:08 PM; Lifecycle Status: Active; Minimum Order: 1; Number of Terminations: 2; Operating Temperature: -55°C ~ 155°C; Package / Case: 0603 (1608 Metric); Packaging: TapeAndReel; PartId: 12919; Part Status: Active; Price: 0.01; Resistance: 4.99 Ohms; Series: RC_L; Size / Dimension: 0.063" L x 0.031" W (1.60mm x 0.80mm); Supplier 1: DigiKey; Supplier Part Number 1: 311-4.99HRCT-ND; Supplier Device Package: 0603; Tolerance: ±1%
TP1-TP3 = 5016: MF: {'manufacturer': u'Keystone Electronics'}; Package: None; MP: 5016; Value: *; Price: None; Availability: Unavailable